# EAGLE design Circuits (EAGLE 6.5.0)

## Sheet 1 of 4: Line following circuits
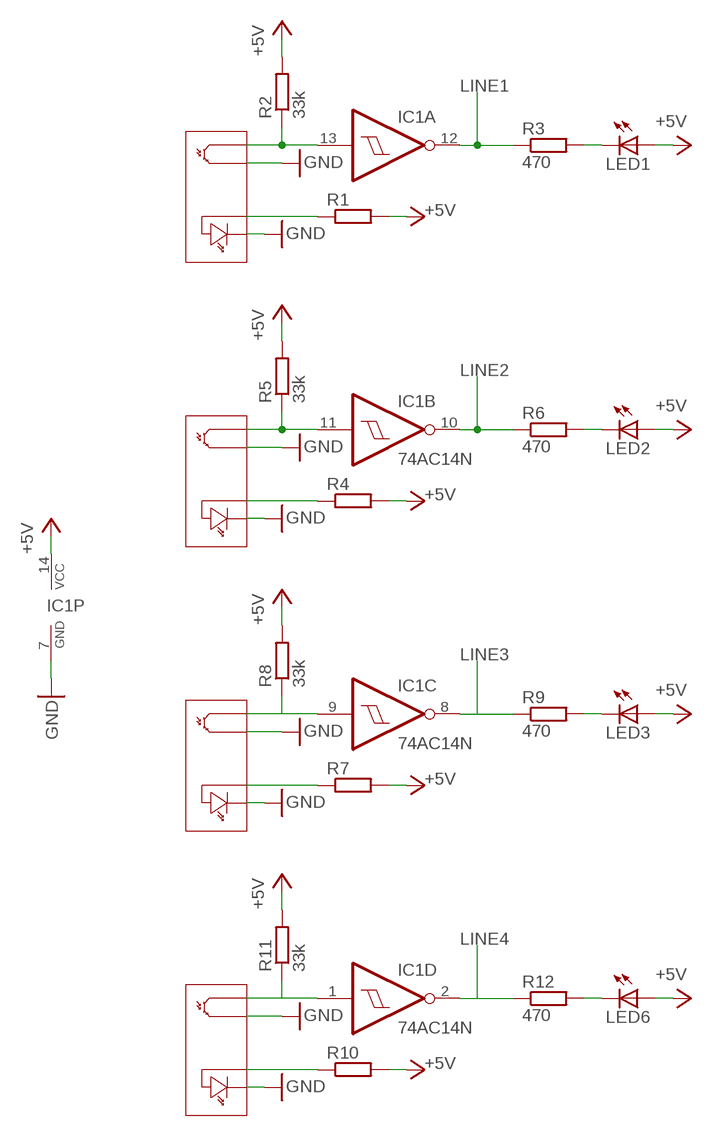
[diagram p0: schematic, sheet 1]

### Parts
IC1  74AC14N  [DIL14]
LED1  TLLR4400  [LED3MM]
LED2  TLLR4400  [LED3MM]
LED3  TLLR4400  [LED3MM]
LED6  TLLR4400  [LED3MM]
R1  R-EU_0207/7  [0207/7]
R2  33k  R-EU_0207/7  [0207/7]
R3  470  R-EU_0207/7  [0207/7]
R4  R-EU_0207/7  [0207/7]
R5  33k  R-EU_0207/7  [0207/7]
R6  470  R-EU_0207/7  [0207/7]
R7  R-EU_0207/7  [0207/7]
R8  33k  R-EU_0207/7  [0207/7]
R9  470  R-EU_0207/7  [0207/7]
R10  R-EU_0207/7  [0207/7]
R11  33k  R-EU_0207/7  [0207/7]
R12  470  R-EU_0207/7  [0207/7]

### Nets
+5V: IC1.14(P:VCC) LED1.A LED2.A LED3.A LED6.A R1.2 R2.2 R4.2 R5.2 R7.2 R8.2 R10.2 R11.2 ; also sheet 2,3,4
GND: IC1.7(P:GND) ; also sheet 2,3,4
LINE1: IC1.12(A:O) R3.1 ; also sheet 2
LINE2: IC1.10(B:O) R6.1 ; also sheet 2
LINE3: IC1.8(C:O) R9.1 ; also sheet 2
LINE4: IC1.2(D:O) R12.1 ; also sheet 2
N$1: IC1.13(A:I) R2.1
N$2: R1.1
N$4: LED1.K(C) R3.2
N$5: IC1.11(B:I) R5.1
N$6: R4.1
N$8: LED2.K(C) R6.2
N$9: IC1.9(C:I) R8.1
N$10: R7.1
N$12: LED3.K(C) R9.2
N$13: IC1.1(D:I) R11.1
N$14: R10.1
N$16: LED6.K(C) R12.2
Unconnected: IC1.3(E:I) IC1.4(E:O) IC1.5(F:I) IC1.6(F:O)

## Sheet 2 of 4: i2c interface
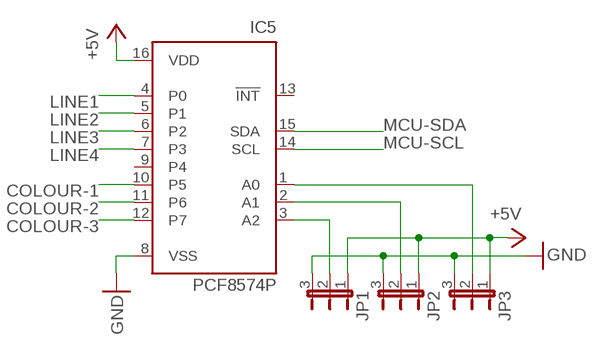
[diagram p1: schematic, sheet 2]

### Parts
IC5  PCF8574P  [DIL16]
JP1  JP2W  [JP2W]
JP2  JP2W  [JP2W]
JP3  JP2W  [JP2W]

### Nets
+5V: IC5.16(VDD) JP1.1 JP2.1 JP3.1 ; also sheet 1,3,4
COLOUR-1: IC5.10(P5) ; also sheet 3,4
COLOUR-2: IC5.11(P6) ; also sheet 3,4
COLOUR-3: IC5.12(P7) ; also sheet 3
GND: IC5.8(VSS) JP1.3 JP2.3 JP3.3 ; also sheet 1,3,4
LINE1: IC5.4(P0) ; also sheet 1
LINE2: IC5.5(P1) ; also sheet 1
LINE3: IC5.6(P2) ; also sheet 1
LINE4: IC5.7(P3) ; also sheet 1
MCU-SCL: IC5.14(SCL)
MCU-SDA: IC5.15(SDA)
N$11: IC5.3(A2) JP1.2
N$15: IC5.2(A1) JP2.2
N$17: IC5.1(A0) JP3.2
Unconnected: IC5.9(P4) IC5.13(!INT)

## Sheet 3 of 4: Colour sensor
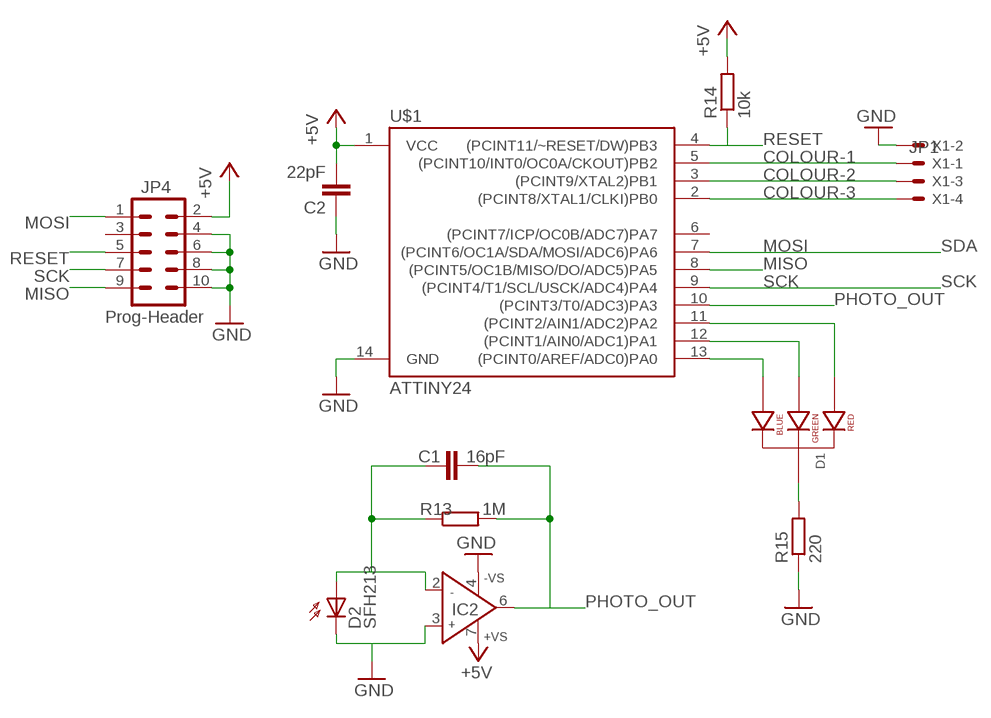
[diagram p2: schematic, sheet 3]

### Parts
C1  16pF  C-EU025-024X044  [C025-024X044]
C2  22pF  C-EU025-024X044  [C025-024X044]
D1  LED-RGB-CC-THRUCLEAR  [LED-RGB-THRU]
D2  SFH213  SFH205  [SFH205]
IC2  mcp603  AD811N  [DIL08]
JP4  Prog-Header  M05X2SHD  [2X5-SHROUDED]
R13  1M  R-EU_0204/5  [0204/5]
R14  10k  R-EU_0207/7  [0207/7]
R15  220  R-EU_0207/7  [0207/7]
U$1  ATTINY24  ATTINY84ATTINY84-20PU  [DIL14]
X1  JP1  22-23-2041  [22-23-2041]

### Nets
+5V: C2.2 IC2.7(+VS) JP4.2 R14.2 U$1.1(VCC) ; also sheet 1,2,4
COLOUR-1: U$1.5((PCINT10/INT0/OC0A/CKOUT)PB2) X1.1 ; also sheet 2,4
COLOUR-2: U$1.3((PCINT9/XTAL2)PB1) X1.3 ; also sheet 2,4
COLOUR-3: U$1.2((PCINT8/XTAL1/CLKI)PB0) X1.4 ; also sheet 2
GND: C2.1 D2.K(C) IC2.3(IN+) IC2.4(-VS) JP4.4 JP4.6 JP4.8 JP4.10 R15.1 U$1.14(GND) X1.2 ; also sheet 1,2,4
MISO: JP4.9 U$1.8((PCINT5/OC1B/MISO/DO/ADC5)PA5)
MOSI: JP4.1 U$1.7((PCINT6/OC1A/SDA/MOSI/ADC6)PA6)
N$3: D1.4(BLUE_CATHODE) U$1.13((PCINT0/AREF/ADC0)PA0)
N$7: D1.3(GREEN_CATHODE) U$1.12((PCINT1/AIN0/ADC1)PA1)
N$18: D1.1(RED_CATHODE) U$1.11((PCINT2/AIN1/ADC2)PA2)
N$19: C1.1 D2.A IC2.2(IN-) R13.1
N$20: D1.2(CATHODE) R15.2
PHOTO_OUT: C1.2 IC2.6(OUT) R13.2 U$1.10((PCINT3/T0/ADC3)PA3) ; also sheet 4
RESET: JP4.5 R14.1 U$1.4((PCINT11/~RESET/DW)PB3)
SCK: JP4.7 U$1.9((PCINT4/T1/SCL/USCK/ADC4)PA4)
Unconnected: JP4.3 U$1.6((PCINT7/ICP/OC0B/ADC7)PA7)

### Notes on the sheet
- SDA
- SCK

## Sheet 4 of 4
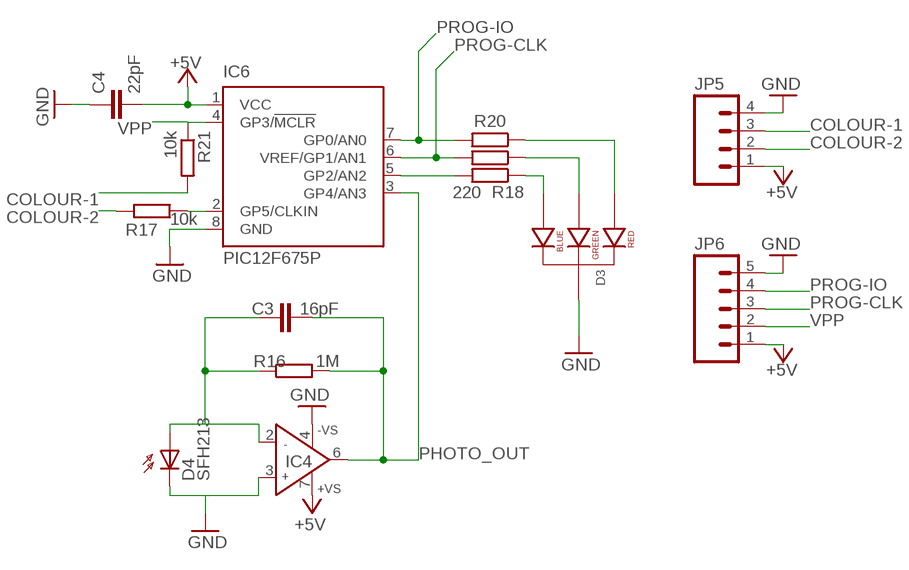
[diagram p3: schematic, sheet 4]

### Parts
C3  16pF  C-EU025-024X044  [C025-024X044]
C4  22pF  C-EU025-024X044  [C025-024X044]
D3  LED-RGB-CC-THRUCLEAR  [LED-RGB-THRU]
D4  SFH213  SFH205  [SFH205]
IC4  mcp603  AD811N  [DIL08]
IC6  PIC12F675P  [DIL8]
JP5  M04LONGPADS  [1X04_LONGPADS]
JP6  M05PTH_LONGPADS  [1X05_LONGPADS]
R16  1M  R-EU_0204/5  [0204/5]
R17  10k  R-EU_0207/7  [0207/7]
R18  220  R-EU_0207/7  [0207/7]
R19  220  R-EU_0207/7  [0207/7]
R20  220  R-EU_0207/7  [0207/7]
R21  10k  R-EU_0207/7  [0207/7]

### Nets
+5V: C4.2 IC4.7(+VS) IC6.1(VCC) JP5.1 JP6.1 ; also sheet 1,2,3
COLOUR-1: JP5.3 R21.2 ; also sheet 2,3
COLOUR-2: JP5.2 R17.1 ; also sheet 2,3
GND: C4.1 D3.2(CATHODE) D4.K(C) IC4.3(IN+) IC4.4(-VS) IC6.8(GND) JP5.4 JP6.5 ; also sheet 1,2,3
N$22: D3.4(BLUE_CATHODE) R18.1
N$23: D3.3(GREEN_CATHODE) R19.1
N$24: IC6.2(GP5/CLKIN) R17.2
N$25: C3.1 D4.A IC4.2(IN-) R16.1
N$28: D3.1(RED_CATHODE) R20.1
N$29: IC6.5(GP2/AN2) R18.2
PHOTO_OUT: C3.2 IC4.6(OUT) IC6.3(GP4/AN3) R16.2 ; also sheet 3
PROG-CLK: IC6.6(VREF/GP1/AN1) JP6.3 R19.2
PROG-IO: IC6.7(GP0/AN0) JP6.4 R20.2
VPP: IC6.4(GP3/!MCLR) JP6.2 R21.1

## Library data of the parts
C1-C4 = resistor:C-EU: CAPACITOR, European symbol
D1 D3 = SparkFun-LED:LED-RGB-CC-THRU: RGB Through-hole common cathode LED SparkFun Storefront: COM-00105 (Clear) COM-09264 (Diffuse); PROD_ID: DIO-08418
D2 D4 = opto-trans-siemens:SFH205: PHOTO DIODE; OC_FARNELL: unknown; OC_NEWARK: unknown
IC1 = 74xx-eu:74*14: Hex schmitt trigger INVERTER
IC2 IC4 = analog-devices:AD811: High Performance Video Op Amp Source: http://www.analog.com/static/imported-files/data_sheets/AD811.pdf; MF: ALTERA CORPORATION; MPN: AD811AN; OC_FARNELL: 1464857; OC_NEWARK: 05F7667
IC5 = micro-philips:PCF8574: I2C-Bus Remote 8-bit I/O expander http://www.semiconductors.philips.com/acrobat_download/datasheets/PCF8574_4.pdf; MPN: PCF8574PN; OC_FARNELL: 204020; OC_NEWARK: 11N8515
IC6 = microchip:PIC12F675: 8-Pin FLASH-Based 8-Bit CMOS Microcontroller Precision Internal 4 MHz oscillator factory calibrated to ±1% Low Power Features: Standby Current: - 1 nA @ 2.0V, typical Operating Current: - 8.5µA @ 32 kHz, 2.0V, typical - 100µA @ 1 MHz, 2.0V, typical Watchdog Timer Current: - 300 nA @ 2.0V, typical Timer1 oscillator current: - 4µA @ 32 kHz, 2.0V, typical Analog-to-Digital Converter module: - 10-bit resolution - Programmable 4-channel input - Voltage reference input Source: http://www.microchip.com .. 41190E.pdf; MF: MICROCHIP; MPN: PIC12F675-E/P; OC_FARNELL: 9759018; OC_NEWARK: 92C4340
JP1-JP3 = jumper:JP2W: JUMPER
JP4 = SparkFun-Connectors:M05X2: Header 5x2 Standard 10-pin dual row 0.1" header. Commonly used with AVR-ISP. Use with Spark Fun Electronics SKU: PRT-00778
JP5 = SparkFun-Connectors:M04: Header 4 Standard 4-pin 0.1" header. Use with straight break away headers (SKU : PRT-00116), right angle break away headers (PRT-00553), swiss pins (PRT-00743), machine pins (PRT-00117), and female headers (PRT-00115). Molex polarized connector foot print use with SKU : PRT-08231 with associated crimp pins and housings. 1MM SMD Version SKU: PRT-10208
JP6 = SparkFun-Connectors:M05: Header 5 Standard 5-pin 0.1" header. Use with straight break away headers (SKU : PRT-00116), right angle break away headers (PRT-00553), swiss pins (PRT-00743), machine pins (PRT-00117), and female headers (PRT-00115). Molex polarized connector foot print use with SKU : PRT-08230 with associated crimp pins and housings.
LED1-LED3 LED6 = led:TLLR4400: Low Current (2mA) LED 3 mm Tinted Diffused Package color RED Source: Data sheet <http://www.farnell.com/datasheets/391100.pdf>; MF: VISHAY SEMICONDUCTOR; OC_FARNELL: 1612437
R1-R21 = resistor:R-EU_: RESISTOR, European symbol
U$1 = SparkFun-DigitalIC:ATTINY84: Atmel 14-pin 2/4/8kB flash uC
X1 = con-molex:22-23-2041: .100" (2.54mm) Center Header - 4 Pin; MF: MOLEX; MPN: 22-23-2041; OC_FARNELL: 1462920; OC_NEWARK: 38C0355

## Board
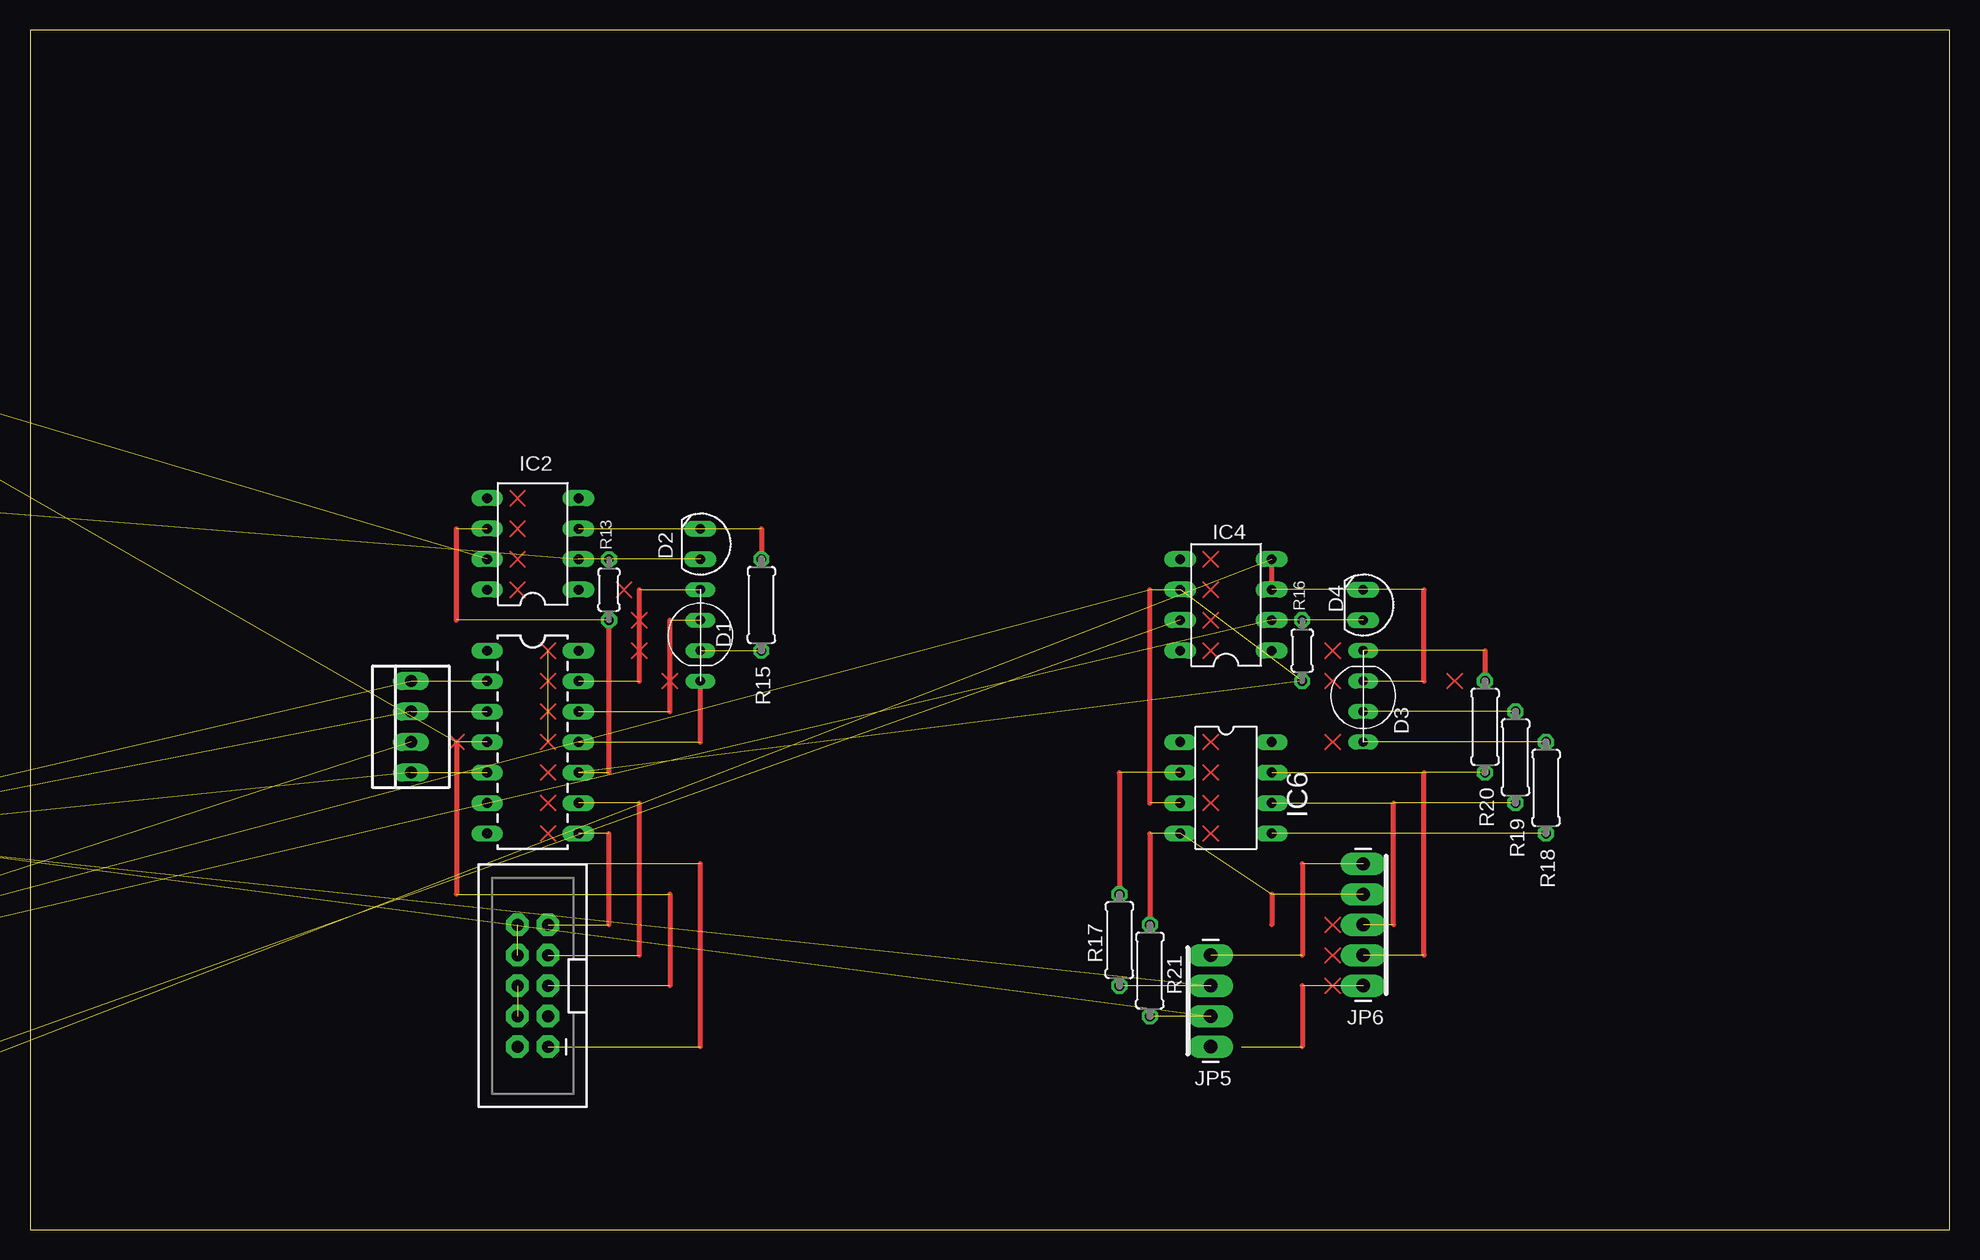
[diagram p4: board, top side]
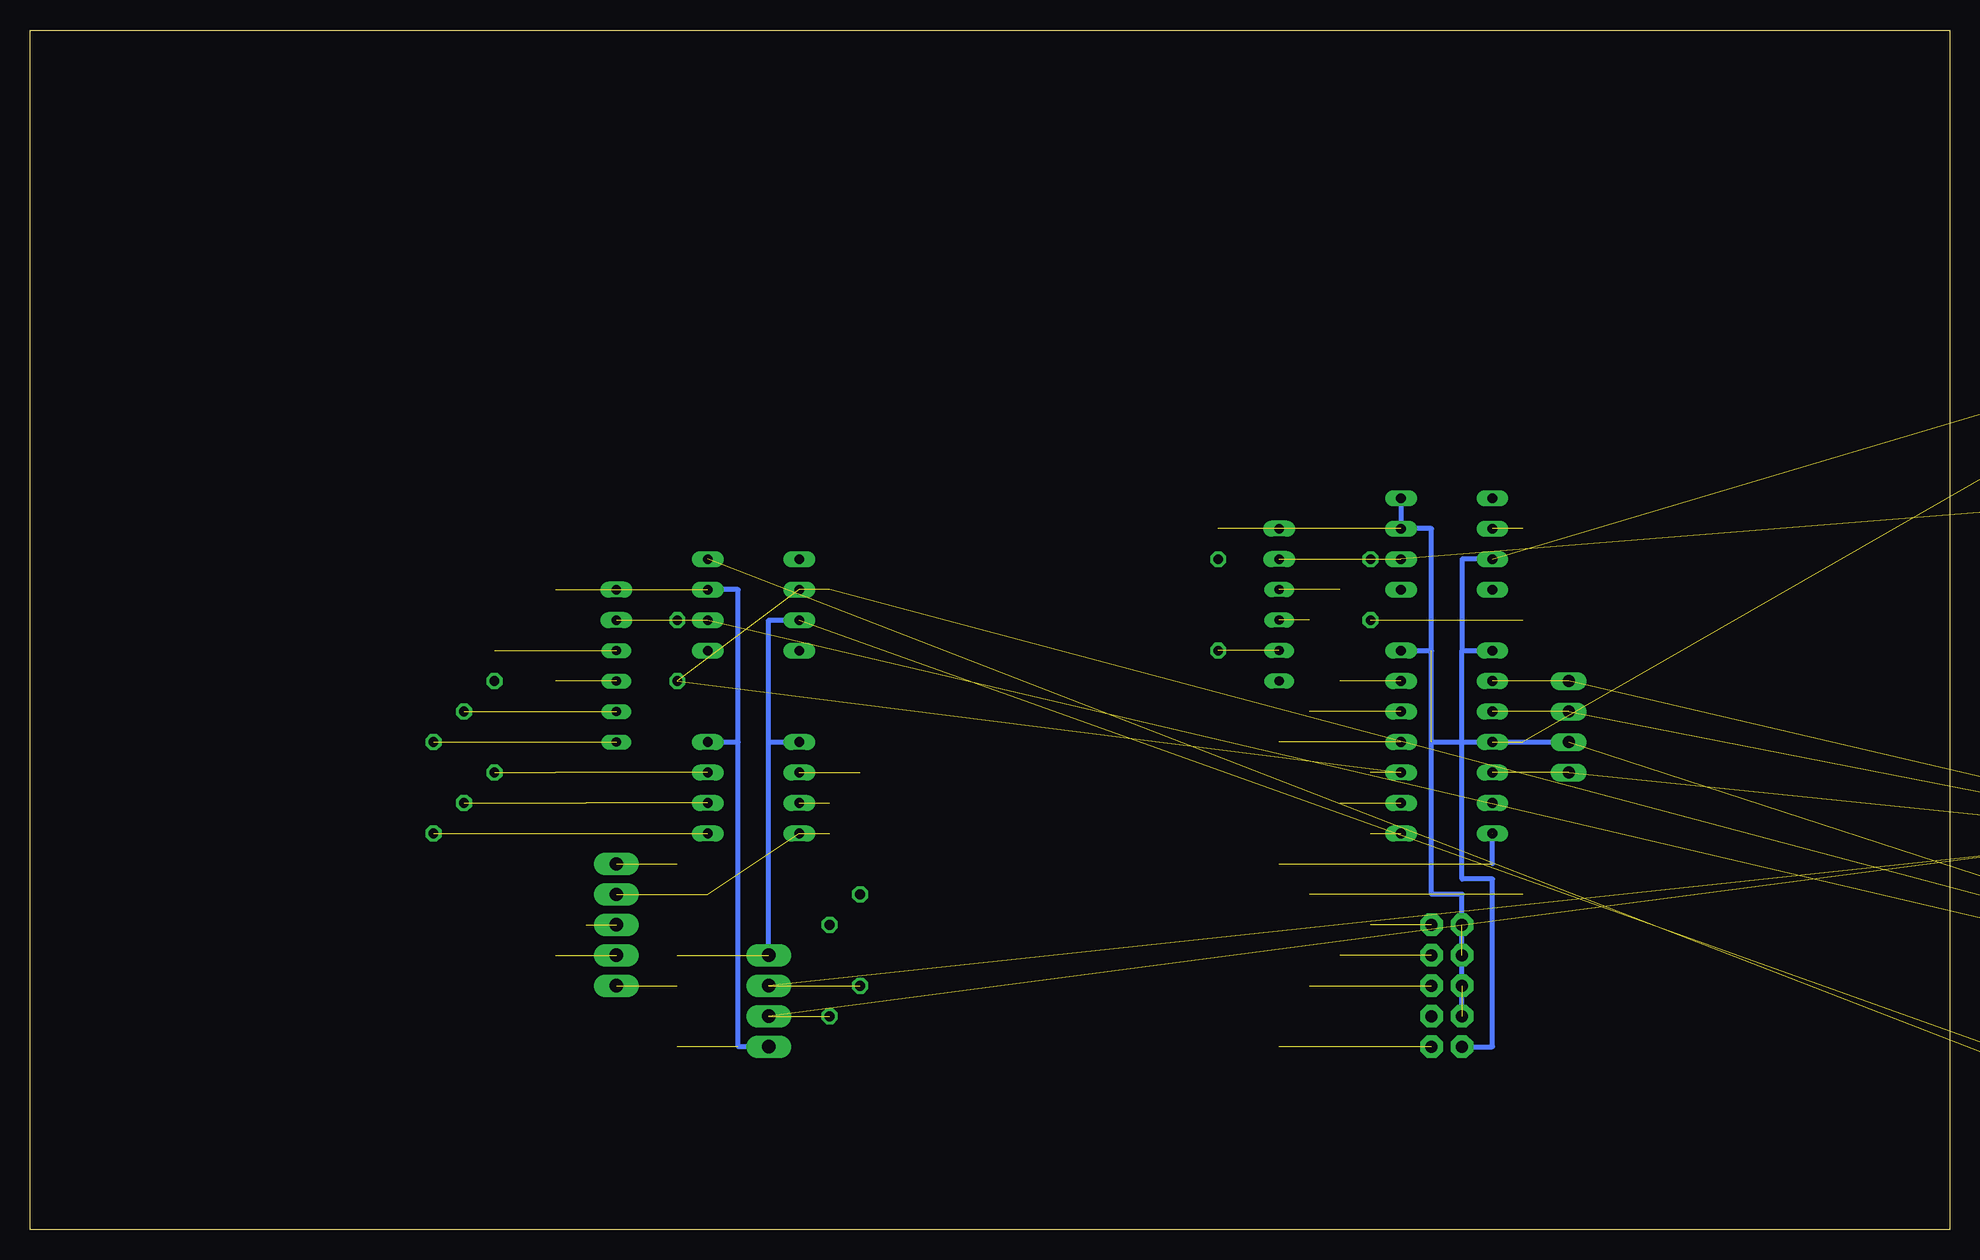
[diagram p5: board, bottom side, seen from below]

Size 160 x 100 mm. Coordinates in mm from the lower left corner, seen from the top.
Outline: 0,0 160,0 160,100 0,100 0,0
Copper layers (1*16): Top 0.035mm / dielectric 1.5mm / Bottom 0.035mm
Design rules "default": minimum track width 10mil, minimum drill 24mil, track to track 8mil, track to pad 8mil, pad to pad 8mil, via to via 8mil, smd to smd 8mil, copper to edge 40mil, drill to drill 8mil, minimum pad ring 10mil, minimum via ring 8mil, stop-mask expansion 4mil, vias tented up to drill 0mil, thermal gap 10mil

### Footprints (pad centres in the part's own frame; a part is rotated, then mirrored left to right if it is on the bottom)
C025-024X044 = drill 0.813 octagon: 1 -1.27,0; 2 1.27,0
LED-RGB-THRU = drill 0.762 pad 0.889 long: 1 3.175,0; 2 0.635,0; 3 -1.905,0; 4 -4.445,0
SFH205 = drill 0.813 long: A 0,-1.27; K 0,1.27
DIL14 = drill 0.813 long: 1 -7.62,-3.81; 2 -5.08,-3.81; 3 -2.54,-3.81; 4 0,-3.81; 5 2.54,-3.81; 6 5.08,-3.81; 7 7.62,-3.81; 8 7.62,3.81; 9 5.08,3.81; 10 2.54,3.81; 11 0,3.81; 12 -2.54,3.81; 13 -5.08,3.81; 14 -7.62,3.81
DIL08 = drill 0.813 long: 1 -3.81,-3.81; 2 -1.27,-3.81; 3 1.27,-3.81; 4 3.81,-3.81; 5 3.81,3.81; 6 1.27,3.81; 7 -1.27,3.81; 8 -3.81,3.81
DIL16 = drill 0.813 long: 1 -8.89,-3.81; 2 -6.35,-3.81; 3 -3.81,-3.81; 4 -1.27,-3.81; 5 1.27,-3.81; 6 3.81,-3.81; 7 6.35,-3.81; 8 8.89,-3.81; 9 8.89,3.81; 10 6.35,3.81; 11 3.81,3.81; 12 1.27,3.81; 13 -1.27,3.81; 14 -3.81,3.81; 15 -6.35,3.81; 16 -8.89,3.81
DIL8 = drill 0.813 long: 1 -3.81,-3.81; 2 -1.27,-3.81; 3 1.27,-3.81; 4 3.81,-3.81; 5 3.81,3.81; 6 1.27,3.81; 7 -1.27,3.81; 8 -3.81,3.81
JP2W = drill 0.914 long: 1 -2.54,-1.27; 2 0,-1.27; 3 2.54,-1.27
2X5-SHROUDED = drill 1.016 pad 1.88 octagon: 1 -1.27,5.08; 2 1.27,5.08; 3 -1.27,2.54; 4 1.27,2.54; 5 -1.27,0; 6 1.27,0; 7 -1.27,-2.54; 8 1.27,-2.54; 9 -1.27,-5.08; 10 1.27,-5.08
1X04_LONGPADS = drill 1.118 pad 1.88 long: 1 0,0; 2 2.54,0; 3 5.08,0; 4 7.62,0
1X05_LONGPADS = drill 1.118 pad 1.88 long: 1 0,0; 2 2.54,0; 3 5.08,0; 4 7.62,0; 5 10.16,0
LED3MM = drill 0.813 octagon: A -1.27,0; K 1.27,0
0207/7 = drill 0.813 octagon: 1 -3.81,0; 2 3.81,0
0204/5 = drill 0.813 octagon: 1 -2.54,0; 2 2.54,0
DIL14' = drill 0.813 long: 1 -8.89,-3.81; 2 -6.35,-3.81; 3 -3.81,-3.81; 4 -1.27,-3.81; 5 1.27,-3.81; 6 3.81,-3.81; 7 6.35,-3.81; 8 6.35,3.81; 9 3.81,3.81; 10 1.27,3.81; 11 -1.27,3.81; 12 -3.81,3.81; 13 -6.35,3.81; 14 -8.89,3.81
22-23-2041 = drill 1 long: 1 -3.81,0; 2 -1.27,0; 3 1.27,0; 4 3.81,0

### Placement (x,y rotation side)
C1  -63.5,64.77 0 top  (outside the outline)
C2  -69.85,64.77 0 top  (outside the outline)
C3  -80.01,7.62 0 top  (outside the outline)
C4  -77.47,17.78 0 top  (outside the outline)
D1  55.88,48.9 270 top
D2  55.88,57.15 0 top
D3  111.12,45.09 90 top
D4  111.12,52.07 0 top
IC1  -46.99,29.21 0 top  (outside the outline)
IC2  41.91,57.15 90 top
IC4  99.69,52.07 90 top
IC5  -24.13,29.21 0 top  (outside the outline)
IC6  99.69,36.83 270 top
JP1  -26.67,3.81 0 top  (outside the outline)
JP2  -36.83,3.81 0 top  (outside the outline)
JP3  -46.99,3.81 0 top  (outside the outline)
JP4  41.91,20.32 180 top
JP5  98.42,22.86 270 top
JP6  111.12,30.48 270 top
LED1  -71.12,-7.62 0 top  (outside the outline)
LED2  -71.12,-12.7 0 top  (outside the outline)
LED3  -71.12,-17.78 0 top  (outside the outline)
LED6  -71.12,-22.86 0 top  (outside the outline)
R1  -25.4,73.66 0 top  (outside the outline)
R2  -35.56,73.66 0 top  (outside the outline)
R3  -45.72,73.66 0 top  (outside the outline)
R4  -55.88,73.66 0 top  (outside the outline)
R5  -66.04,73.66 0 top  (outside the outline)
R6  -17.78,80.01 0 top  (outside the outline)
R7  -27.94,80.01 0 top  (outside the outline)
R8  -38.1,80.01 0 top  (outside the outline)
R9  -48.26,80.01 0 top  (outside the outline)
R10  -58.42,80.01 0 top  (outside the outline)
R11  -68.58,80.01 0 top  (outside the outline)
R12  -17.78,85.09 0 top  (outside the outline)
R13  48.26,53.34 270 top
R14  -38.1,85.09 0 top  (outside the outline)
R15  60.96,52.07 270 top
R16  106.05,48.26 270 top
R17  90.81,24.13 90 top
R18  126.36,36.83 270 top
R19  123.83,39.37 270 top
R20  121.28,41.91 270 top
R21  93.34,21.59 270 top
U$1  ATTINY24  [DIL14']  41.91,39.37 270 top
U$2  [BREAK]  108.58,45.72 0 top
U$3  [BREAK]  43.18,33.02 0 top
U$4  [BREAK]  43.18,35.56 0 top
U$5  [BREAK]  43.18,38.1 0 top
U$6  [BREAK]  43.18,40.64 0 top
U$7  [BREAK]  43.18,43.18 0 top
U$8  [BREAK]  43.18,45.72 0 top
U$9  [BREAK]  43.18,48.26 0 top
U$10  [BREAK]  40.64,53.34 0 top
U$11  [BREAK]  40.64,55.88 0 top
U$12  [BREAK]  40.64,58.42 0 top
U$13  [BREAK]  40.64,60.96 0 top
U$14  [BREAK]  49.53,53.34 0 top
U$15  [BREAK]  50.8,48.26 0 top
U$16  [BREAK]  108.58,48.26 0 top
U$17  [BREAK]  98.42,48.26 0 top
U$18  [BREAK]  98.42,50.8 0 top
U$19  [BREAK]  98.42,53.34 0 top
U$20  [BREAK]  98.42,55.88 0 top
U$21  [BREAK]  98.42,40.64 0 top
U$22  [BREAK]  98.42,38.1 0 top
U$23  [BREAK]  98.42,35.56 0 top
U$24  [BREAK]  98.42,33.02 0 top
U$25  [BREAK]  118.75,45.72 0 top
U$26  [BREAK]  108.58,40.64 0 top
U$27  [BREAK]  108.58,22.86 0 top
U$28  [BREAK]  108.58,20.32 0 top
U$29  [BREAK]  108.58,25.4 0 top
U$30  [BREAK]  50.8,50.8 0 top
U$31  [BREAK]  53.34,45.72 0 top
U$32  [BREAK]  35.56,40.64 0 top
X1  31.75,41.91 90 top

### Tracks (layer width: path | path; a pad name or v marks a point on that pad's centre or on a via)
+5V  (23 unrouted)
  Top 0.406: 106.05,30.48 106.05,22.86
  Bottom 0.406: 98.42,40.64 98.42,50.8 IC4.7 | JP5.1 98.42,40.64 | 98.42,40.64 IC6.1 | JP4.2 38.1,15.24 38.1,29.21 40.64,29.21 40.64,48.26 | 40.64,48.26 U$1.1 | IC2.7 40.64,55.88 40.64,48.26
COLOUR-1  (4 unrouted)
COLOUR-2  (4 unrouted)
COLOUR-3  (2 unrouted)
GND  (18 unrouted)
  Top 0.406: 116.2,45.72 116.2,53.34 | IC4.3 IC4.4 | 106.05,20.32 106.05,15.24 | 60.96,58.42 R15.1
  Bottom 0.406: IC6.8 100.97,40.64 | 100.97,40.64 100.97,53.34 IC4.3 | JP5.4 100.97,15.24 100.97,40.64 | IC2.4 IC2.3 43.18,58.42 43.18,48.26 | U$1.14 43.18,48.26 | JP4.4 JP4.10 40.64,27.94 43.18,27.94 43.18,40.64 | 43.18,40.64 43.18,48.26 | 43.18,40.64 X1.2
LINE1  (2 unrouted)
LINE2  (2 unrouted)
LINE3  (2 unrouted)
LINE4  (2 unrouted)
MISO  (2 unrouted)
  Top 0.406: 48.26,25.4 48.26,33.02
MOSI  (3 unrouted)
  Top 0.406: 55.88,15.24 55.88,30.48
  Bottom 0.406: 38.1,30.48 U$1.7
N$1  (1 unrouted)
N$3  (2 unrouted)
  Top 0.406: 50.8,45.72 50.8,53.34
N$4  (1 unrouted)
N$5  (1 unrouted)
N$7  (2 unrouted)
  Top 0.406: 53.34,43.18 53.34,50.8
N$8  (1 unrouted)
N$9  (1 unrouted)
N$11  (1 unrouted)
N$12  (1 unrouted)
N$13  (1 unrouted)
N$15  (1 unrouted)
N$16  (1 unrouted)
N$17  (1 unrouted)
N$18  (1 unrouted)
  Top 0.406: 55.88,40.64 D1.1
N$19  (3 unrouted)
N$20  (1 unrouted)
N$22  (1 unrouted)
N$23  (1 unrouted)
N$24  (1 unrouted)
  Top 0.406: 90.81,38.1 R17.2
N$25  (3 unrouted)
N$28  (1 unrouted)
  Top 0.406: 121.28,48.26 R20.1
N$29  (1 unrouted)
PHOTO_OUT  (9 unrouted)
  Top 0.406: 93.34,35.56 93.34,53.34 | 35.56,50.8 35.56,58.42 | 48.26,38.1 R13.2
PROG-CLK  (3 unrouted)
  Top 0.406: 113.67,25.4 113.67,35.56
PROG-IO  (3 unrouted)
  Top 0.406: 116.2,22.86 116.2,38.1
RESET  (4 unrouted)
  Top 0.406: 35.56,40.64 35.56,27.94 | 53.34,27.94 53.34,20.32
SCK  (2 unrouted)
  Top 0.406: 50.8,22.86 50.8,35.56
VPP  (3 unrouted)
  Top 0.406: 93.34,33.02 R21.1 | 103.5,27.94 103.5,25.4